# Altium schematic sheet integrated_driver_and_current_sense - Copy.SchDoc
size A3
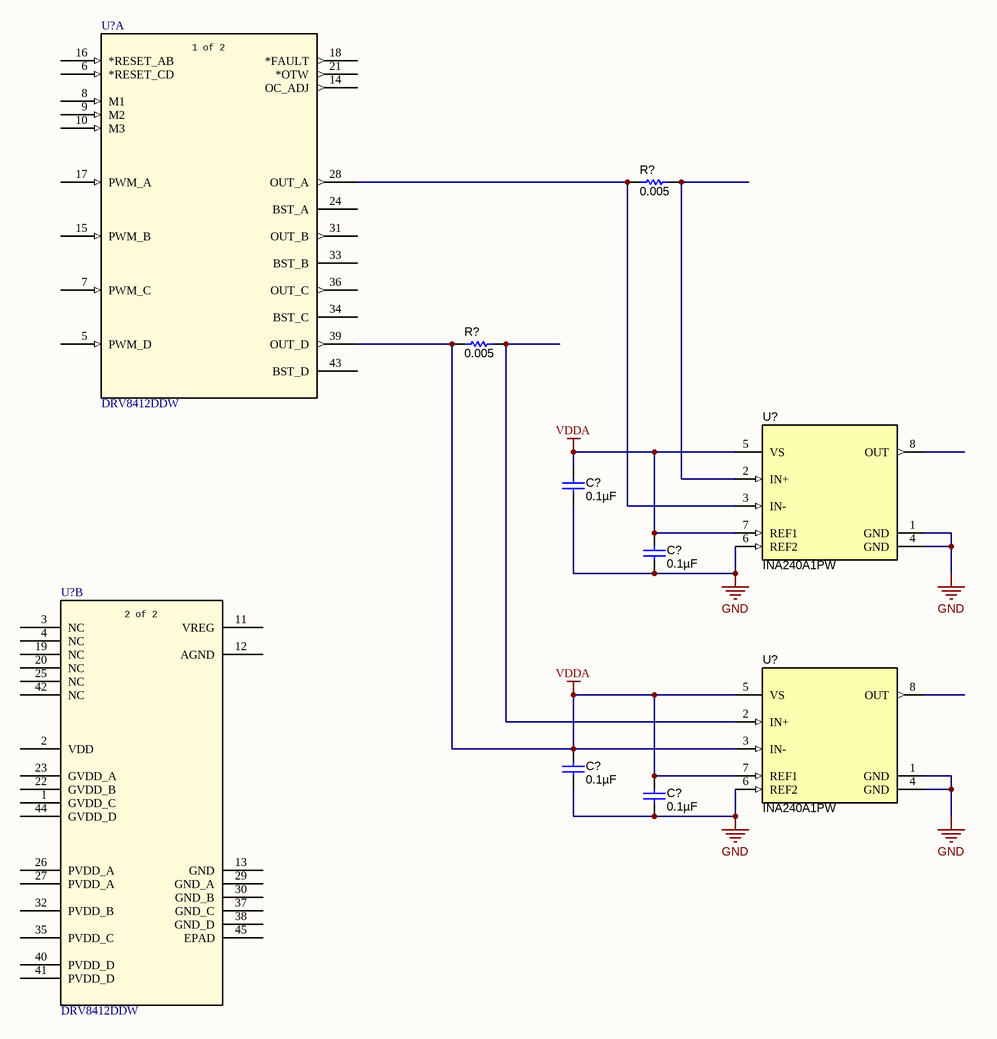
[diagram p0: integrated_driver_and_current_sense - Copy.SchDoc]

## Parts
(Parts that share a designator on the sheet are numbered #1, #2 ... from top to bottom, then left to right.)
C?#1  ValueDisplayed: 0.1µF  [0402]  (hidden comment: GCM155R71C104KA55D)
C?#2  ValueDisplayed: 0.1µF  [0402]  (hidden comment: GCM155R71C104KA55D)
C?#3  ValueDisplayed: 0.1µF  [0402]  (hidden comment: GCM155R71C104KA55D)
C?#4  ValueDisplayed: 0.1µF  [0402]  (hidden comment: GCM155R71C104KA55D)
R?#1  ValueDisplayed: 0.005  [CRE2512-R5_R9]  (hidden comment: CRE2512-FZ-R005E-3)
R?#2  ValueDisplayed: 0.005  [CRE2512-R5_R9]  (hidden comment: CRE2512-FZ-R005E-3)
U?#1  DRV8412DDW  [DDW44-7600X3850TP_N]  (part A of 2)
U?#2  INA240A1PW  [PW0008A_N]
U?#3  DRV8412DDW  [DDW44-7600X3850TP_N]  (part B of 2)
U?#4  INA240A1PW  [PW0008A_N]

## Nets
GND: C?#1.2 C?#2.1 C?#3.2 C?#4.1 U?#2.1(GND) U?#2.4(GND) U?#2.6(REF2) U?#4.1(GND) U?#4.4(GND) U?#4.6(REF2)
VDDA: C?#1.1 C?#2.2 C?#3.1 C?#4.2 R?#2.1 U?#1.39(OUT_D) U?#2.5(VS) U?#2.7(REF1) U?#4.3(IN-) U?#4.5(VS) U?#4.7(REF1)
NetR?#1_1: R?#1.1 U?#1.28(OUT_A) U?#2.3(IN-)
NetR?#1_2: R?#1.2 U?#2.2(IN+)
NetR?#2_2: R?#2.2 U?#4.2(IN+)

Not connected (* = marked no-connect by the designer): U?#1 5(PWM_D) 6(*RESET_CD) 7(PWM_C) 8(M1) 9(M2) 10(M3) 14(OC_ADJ) 15(PWM_B) 16(*RESET_AB) 17(PWM_A) 18(*FAULT) 21(*OTW) 24(BST_A) 31(OUT_B) 33(BST_B) 34(BST_C) 36(OUT_C) 43(BST_D); U?#2 8(OUT); U?#3 1(GVDD_C) 2(VDD) 3(NC) 4(NC) 11(VREG) 12(AGND) 13(GND) 19(NC) 20(NC) 22(GVDD_B) 23(GVDD_A) 25(NC) 26(PVDD_A) 27(PVDD_A) 29(GND_A) 30(GND_B) 32(PVDD_B) 35(PVDD_C) 37(GND_C) 38(GND_D) 40(PVDD_D) 41(PVDD_D) 42(NC) 44(GVDD_D) 45(EPAD); U?#4 8(OUT)

## Notes on the sheet
- (in symbol DRV8412DDW, part A) 1 of 2
- (in symbol DRV8412DDW, part B) 2 of 2

## Library data of the parts
C?#1-C?#4 = GCM155R71C104KA55D: CAP, CERM, 0.1 µF, 16 V, +/- 10%, X7R, 0402; Manufacturer: MuRata; Polarized: N; CompType: Capacitor; Value: 0.1uF; U/M: EA; Cap_F: 0.0000001; Tolerance_%: 10; Value1: Unknown; VDC_V: 16; Value2: 16V; TaMin_C: -55; TaMax_C: 125; AEC Category: Q200; SymbolVersion: 2008-07-09; PartNumber: GCM155R71C104KA55D; PackageReference: 0402; RoHS: Y; MountType: SMT; Technology: Ceramic; TempCo: X7R; Cap_Case: 0402; Published: 2008-06-19; Publisher: Texas Instruments; LatestRevisionDate: 2016-03-12; ComponentLink1Description: Datasheet link; ComponentLink1URL: http://psearch.murata.com/capacitor/product/GCM155R71C104KA55%23.pdf; Supplier 1: Digi-Key; Supplier Part Number 1: 490-4759-2-ND; AEC Qualified: ?
R?#1 R?#2 = CRE2512-FZ-R005E-3: RES, 0.005, 1%, 3 W, AEC-Q200 Grade 0, 2512; Manufacturer: Bourns; CompType: Resistor; Value: 0.005; Value_Code: 5L000; Tolerance_%: 1; Power_W: 3; Value2: 3W; TempCo: 75 ppm/C; EIA_Code: E96; U/M: EA; AEC Category: Q200; AEC Qualified: Y; AEC Grade: 0; SizeArea_mm2: 21.6075; SizeX_mm: 6.45; SizeY_mm: 3.35; SizeZ_mm: 0.9; SymbolVersion: 2009-05-29; PartNumber: CRE2512-FZ-R005E-3; PackageReference: 2512; RoHS: Y; Res_ohm: 0.005; Value1: 1%; MountType: SMT; Technology: Metal Film; Published: 2008-06-26; Publisher: Texas Instruments; LatestRevisionDate: 2016-06-02; ComponentLink1Description: Datasheet link; ComponentLink1URL: http://www.bourns.com/docs/Product-Datasheets/CRE.pdf; Supplier 1: Digi-Key; Supplier Part Number 1: CRE2512-FZ-R005E-3CT-ND; Supplier 2: Mouser; Supplier Part Number 2: 652-CRE2512FZR005E-3; Supplier 3: Farnell; Supplier Part Number 3: 2434014
U?#1 U?#3 = DRV8412DDW: Dual Full-Bridge PWM Motor Driver; Manufacturer: Texas Instruments; Built_By: EMA_UL_Team; Manufacturer_Part_Number: DRV8412DDW; Vendor: Texas Instruments; RefDes: RefDes; Type: DEV; Value: Value
U?#2 U?#4 = INA240A1PW: Wide Common-Mode Range, Voltage Output, High or Low-Side Bi-Directional Zero-Drift Current Shunt Monitor, PW0008A; Manufacturer: Texas Instruments; SymbolCreator: Altium; CompType: IC; U/M: EA; SymbolVersion: 2016-01-07; PartNumber: INA240A1PW; PackageReference: PW0008A; MountType: SMT; ComponentLink1Description: Datasheet Link; ComponentLink1URL: https://sps06.itg.ti.com/sites/KMS/crossdivteams/altium/docs/ComponentDatasheets/INA240 Prelim DS - 9-15-15.pdf; Publisher: Texas Instruments; LatestRevisionDate: 2016-03-14; Alternate Manufacturer: Texas Instruments